# EAGLE schematic espcam (EAGLE 9.6.2)
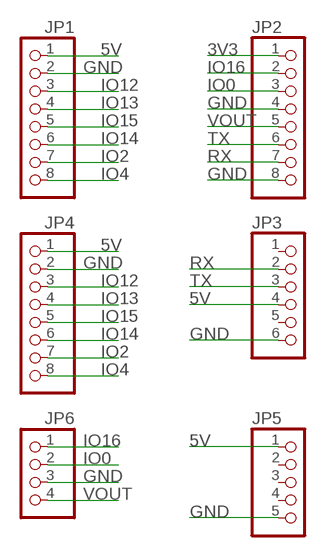
[diagram p0: schematic, sheet 1]

## Parts
JP1  PINHD-1X8  [1X08]
JP2  PINHD-1X8  [1X08]
JP3  PINHD-1X6  [1X06]
JP4  PINHD-1X8  [1X08]
JP5  PINHD-1X5  [1X05]
JP6  PINHD-1X4  [1X04]

## Nets
3V3: JP2.1
5V: JP1.1 JP3.4 JP4.1 JP5.1
GND: JP1.2 JP2.4 JP2.8 JP3.6 JP4.2 JP5.5 JP6.3
IO0: JP2.3 JP6.2
IO2: JP1.7 JP4.7
IO4: JP1.8 JP4.8
IO12: JP1.3 JP4.3
IO13: JP1.4 JP4.4
IO14: JP1.6 JP4.6
IO15: JP1.5 JP4.5
IO16: JP2.2 JP6.1
RX: JP2.7 JP3.2
TX: JP2.6 JP3.3
VOUT: JP2.5 JP6.4
Unconnected: JP3.1 JP3.5 JP5.2 JP5.3 JP5.4

## Library data of the parts
JP1 JP2 JP4 = pinhead:PINHD-1X8: PIN HEADER
JP3 = pinhead:PINHD-1X6: PIN HEADER
JP5 = pinhead:PINHD-1X5: PIN HEADER
JP6 = pinhead:PINHD-1X4: PIN HEADER